# EAGLE design snes_breakout (EAGLE 6.5.0)
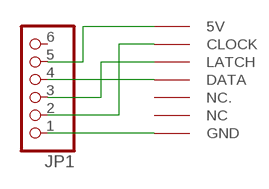
[diagram p0: schematic, sheet 1]

## Parts
JP1  PINHD-1X6  [1X06]
U$1  SNESCONN  [SNESCONN]

## Nets
5V: JP1.5 U$1.5V
CLOCK: JP1.2 U$1.CLOCK
DATA: JP1.4 U$1.DATA
GND: JP1.1 U$1.GND
LATCH: JP1.3 U$1.LATCH
Unconnected: JP1.6 U$1.NC U$1.NC.

## Library data of the parts
JP1 = pinhead:PINHD-1X6: PIN HEADER
U$1 = gamepad-conn:SNESCONN

## Board
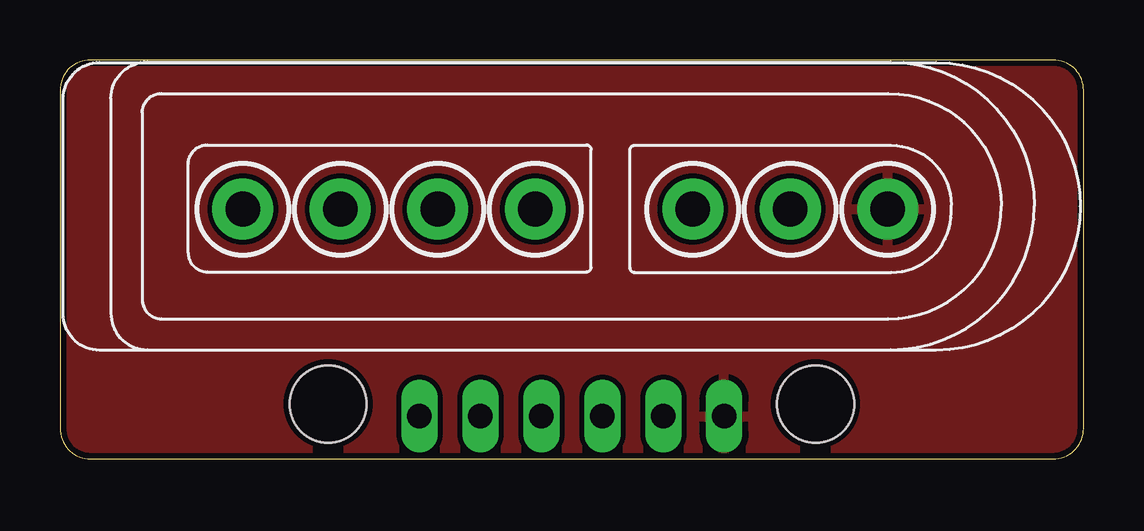
[diagram p1: board, top side]
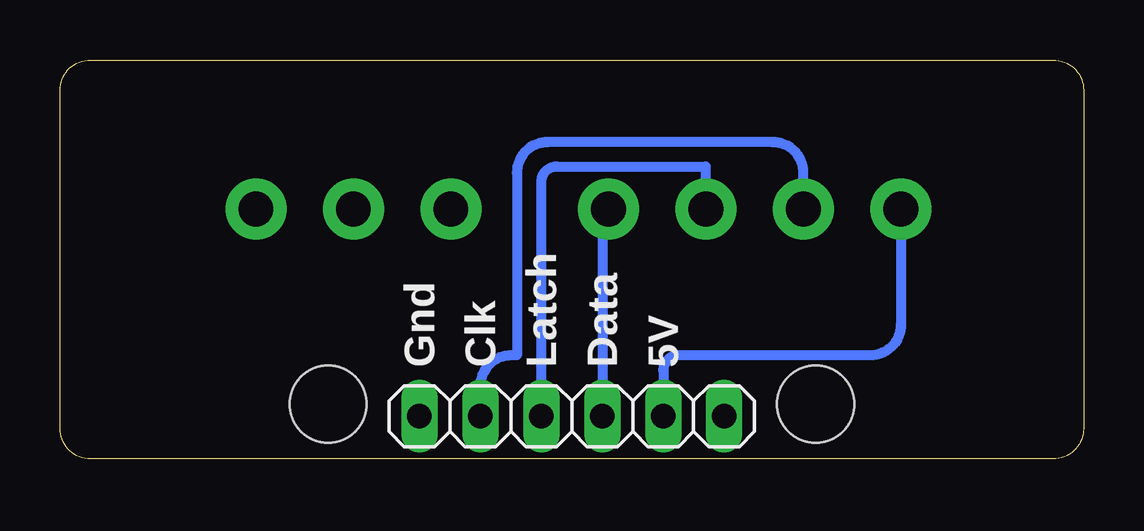
[diagram p2: board, bottom side, seen from below]

Size 42.67 x 16.64 mm. Coordinates in mm from the lower left corner, seen from the top.
Outline: 41.4,16.64 1.27,16.64 arc90 0,15.37 0,1.27 arc90 1.27,0 41.4,0 arc90 42.67,1.27 42.67,15.37 arc90 41.4,16.64
Copper layers (1*16): Top 0.035mm / dielectric 1.5mm / Bottom 0.035mm
Design rules "default *": minimum track width 10mil, minimum drill 24mil, track to track 8mil, track to pad 8mil, pad to pad 8mil, via to via 8mil, smd to smd 8mil, copper to edge 10mil, drill to drill 8mil, minimum pad ring 10mil, minimum via ring 8mil, stop-mask expansion 4mil, vias tented up to drill 0mil, thermal gap 10mil
Holes 3.2 mm at 11.18,2.29 31.5,2.29

### Footprints (pad centres in the part's own frame; a part is rotated, then mirrored left to right if it is on the bottom)
1X06 = drill 1.016 long: 1 -6.35,0; 2 -3.81,0; 3 -1.27,0; 4 1.27,0; 5 3.81,0; 6 6.35,0
SNESCONN = drill 1.448 pad 2.54: 5V 0,4.064; CLOCK 4.064,4.064; DATA 12.192,4.064; GND 26.884,4.064; LATCH 8.128,4.064; NC 18.756,4.064; NC. 22.82,4.064

### Placement (x,y rotation side)
JP1  21.34,1.78 0 bottom
U$1  7.62,6.35 0 top

### Tracks (layer width: path | path; a pad name or v marks a point on that pad's centre or on a via)
5V
  Bottom 0.406: U$1.5V 7.62,5.59 arc90 8.89,4.32 16.89,4.32 arc-90 17.53,3.68 JP1.5
CLOCK
  Bottom 0.406: U$1.CLOCK 11.68,11.94 arc-90 12.95,13.21 22.35,13.21 arc-90 23.62,11.94 23.62,4.32 23.88,4.32 arc-90 25.15,3.05 JP1.2
DATA
  Bottom 0.406: U$1.DATA 20.07,10.41 JP1.4
GND
  pour Top: 0,0 43.18,0 43.18,16.51 0,16.51
LATCH
  Bottom 0.406: JP1.3 22.61,11.56 arc90 21.97,12.19 15.75,12.19 U$1.LATCH

### Text on the board
bNames: 5V | Data | Latch | Clk | Gnd